# EasyEDA schematic 1-Schematic_EMWAVER_V2_433_RAINSUN.json
TITLE: Sheet_1; REV: 1.0; Date: 2022-12-25; Sheet: 1/1; Drawn By: maarnotto; Company: Your Company
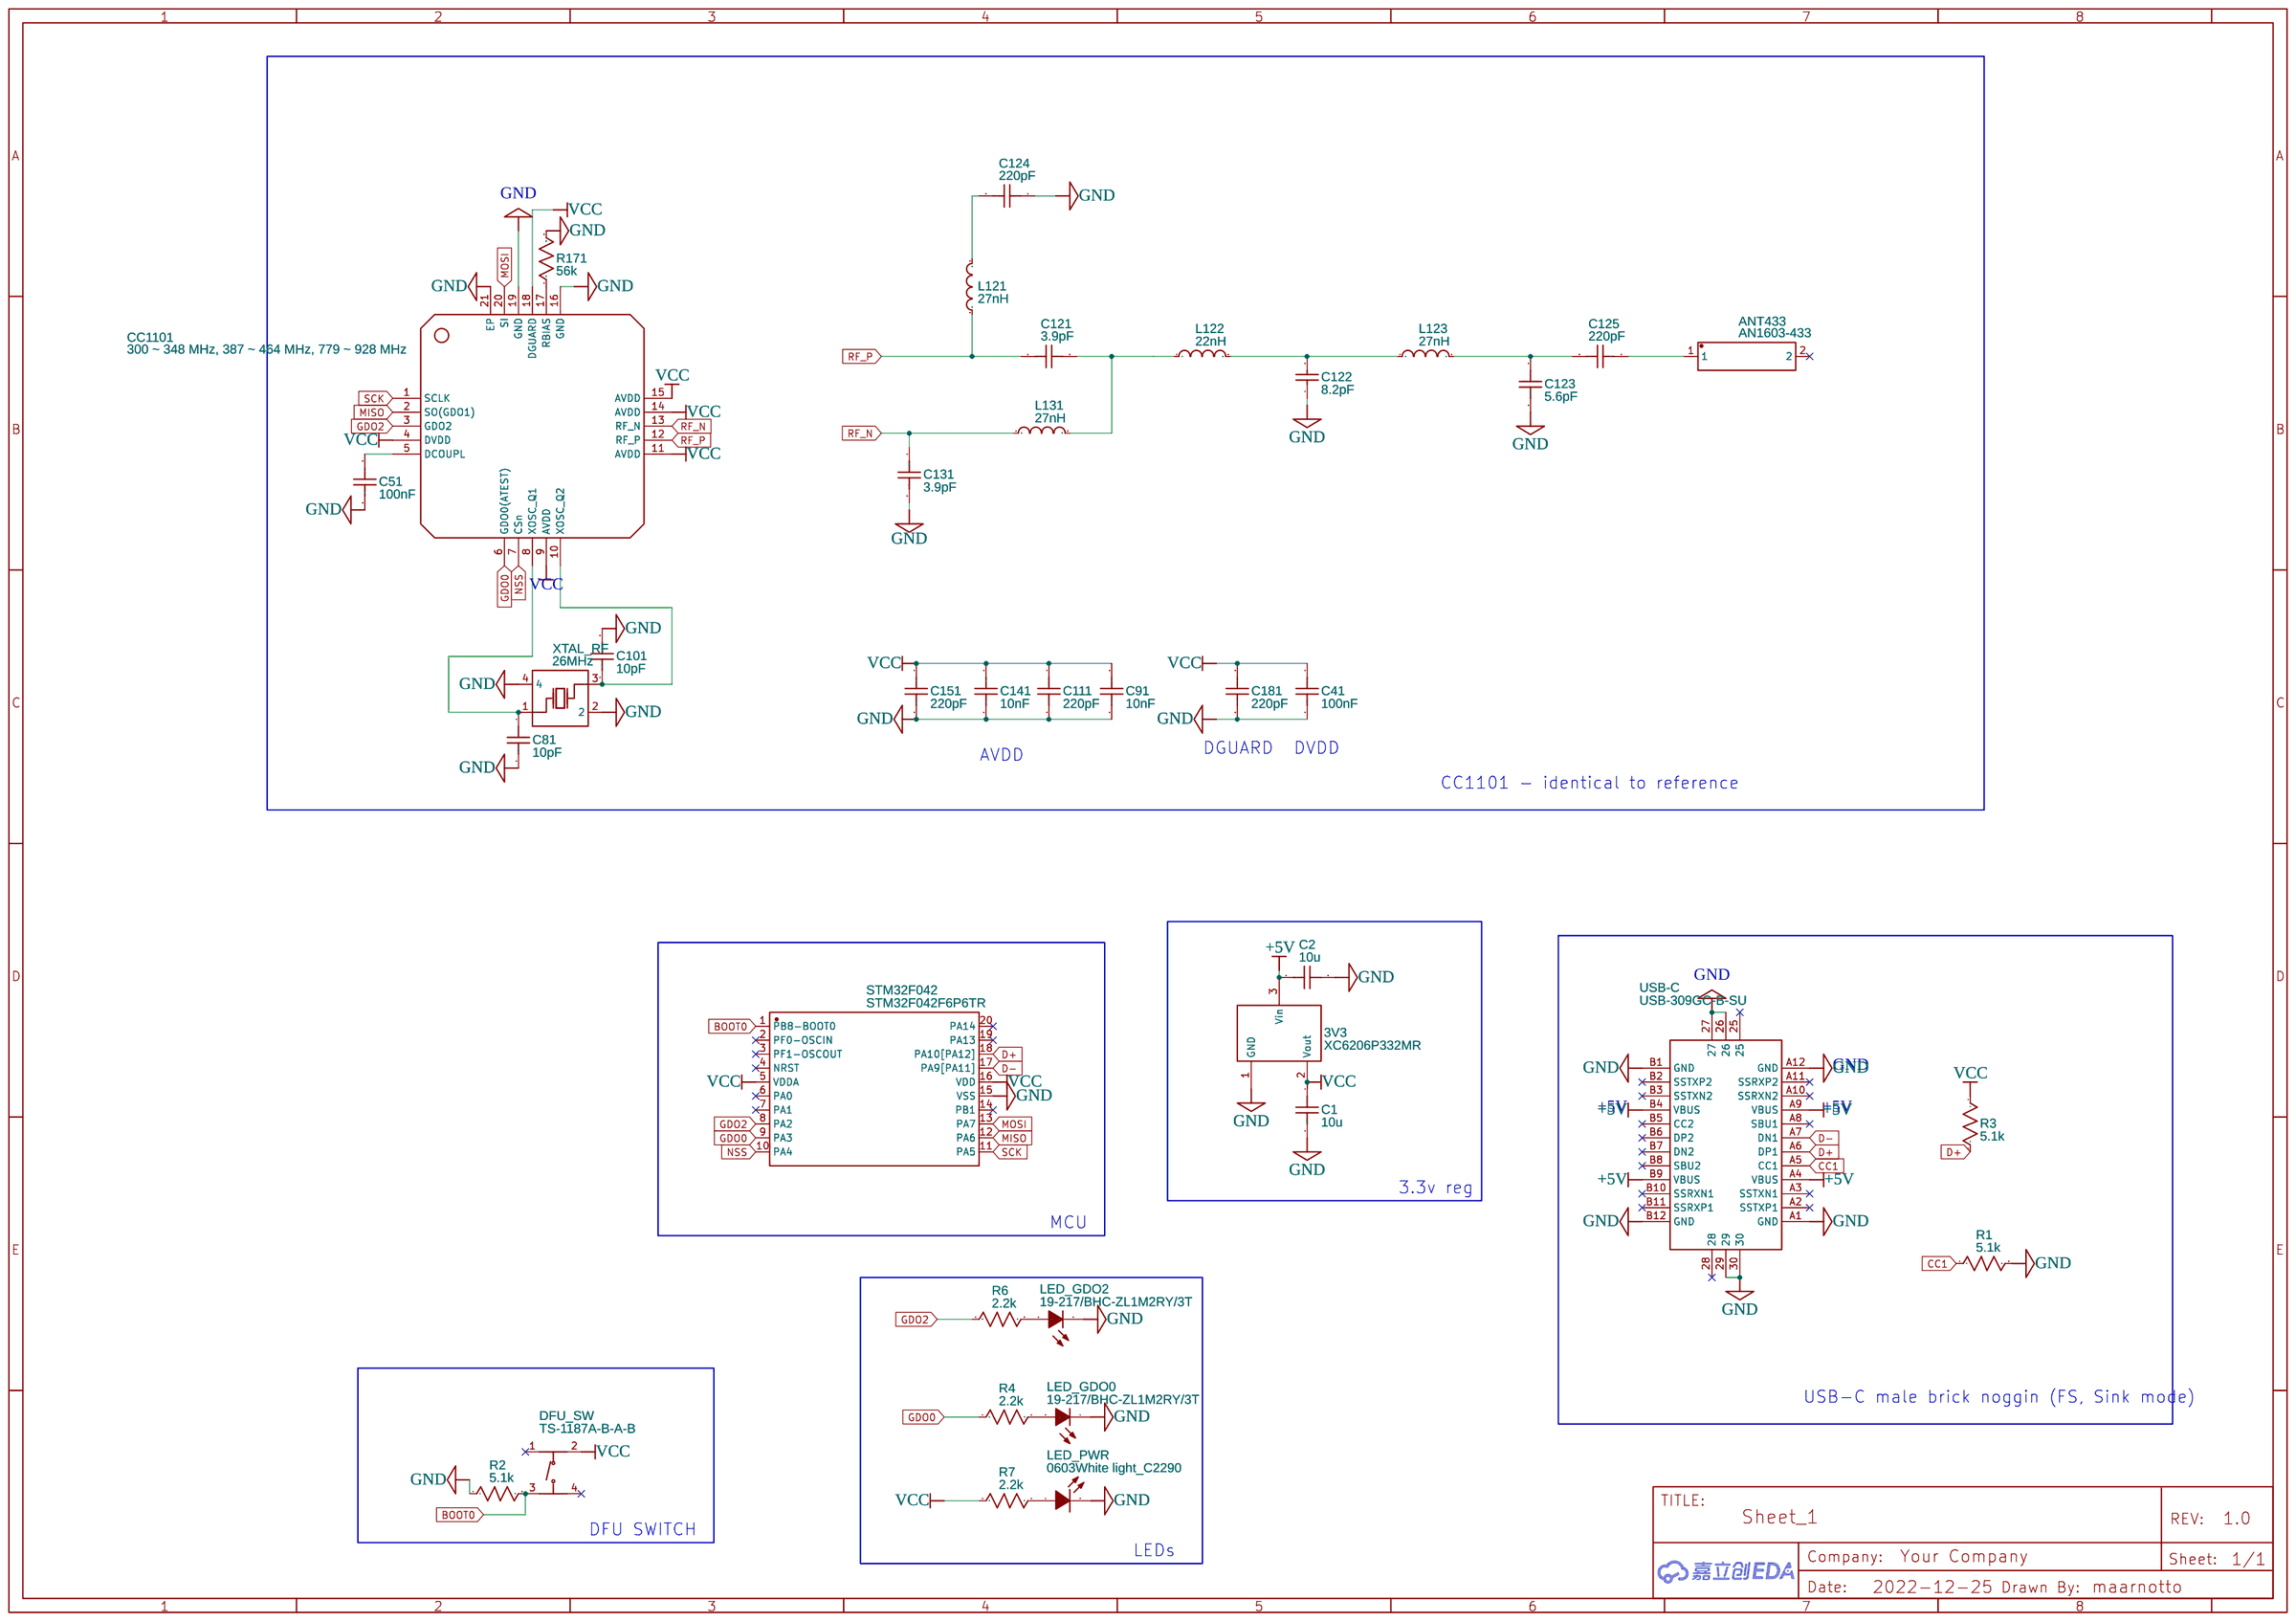
[diagram p0: schematic sheet]

## Parts
3V3  XC6206P332MR  [SOT-23-3_L2.9-W1.6-P1.90-LS2.8-BR]
ANT433  AN1603-433  [ANT-SMD_L16.0-W3.1]
C1  10u  [C0603]
C2  10u  [C0603]
C41  100nF  [C0402]
C51  100nF  [C0402]
C81  10pF  [C0402]
C91  10nF  [C0402]
C101  10pF  [C0402]
C111  220pF  [C0402]
C121  3.9pF  [C0402]
C122  8.2pF  [C0402]
C123  5.6pF  [C0402]
C124  220pF  [C0402]
C125  220pF  [C0402]
C131  3.9pF  [C0402]
C141  10nF  [C0402]
C151  220pF  [C0402]
C181  220pF  [C0402]
CC1101  300 ~ 348 MHz, 387 ~ 464 MHz, 779 ~ 928 MHz  [QFN-20_L4.0-W4.0-P0.5-TL-EP]
DFU_SW  TS-1187A-B-A-B  [SW-SMD_4P-L5.1-W5.1-P3.70-LS6.5-TL-2]
L121  27nH  [L0402]
L122  22nH  [L0402]
L123  27nH  [L0402]
L131  27nH  [L0402]
LED_GDO0  19-217/BHC-ZL1M2RY/3T  [LED0603-RD]
LED_GDO2  19-217/BHC-ZL1M2RY/3T  [LED0603-RD]
LED_PWR  0603White light_C2290  [LED0603-R-RD_WHITE]
R1  5.1k  [R0603]
R2  5.1k  [R0603]
R3  5.1k  [R0603]
R4  2.2k  [R0603]
R6  2.2k  [R0603]
R7  2.2k  [R0603]
R171  56k  [R0402]
STM32F042  STM32F042F6P6TR  [TSSOP-20_L6.5-W4.4-P0.65-LS6.4-BL]
USB-C  USB-309GC-B-SU  [USB-C-SMD_USB-309GC-B-SU]
XTAL_RF  26MHz  [CRYSTAL-SMD_4P-L3.2-W2.5-BL]

## Library data of the parts
3V3 = XC6206P332MR: Supplier: LCSC; Manufacturer: TOREX(特瑞仕); Supplier Part: C5446; JLCPCB Part Class: Basic Part
ANT433 = AN1603-433: Supplier: LCSC; Supplier Part: C122806; Manufacturer: rainsun(霖昱微); Contributor: LCSC; JLCPCB Part Class: Extended Part
C1 C2 = C_0603_US: Contributor: LCEDA_Lib
C41 C51 C81 C91 C101 C111 C121 C123-C125 C131 C141 C151 C181 = C_0402_US: Contributor: LCEDA_Lib
C122 = 0402CG8R2C500NT: Supplier: LCSC; Manufacturer: FH(风华); Supplier Part: C1579; JLCPCB Part Class: Extended Part
CC1101 = CC1101RGPR: Supplier: LCSC; Manufacturer: TI(德州仪器); Supplier Part: C29953; JLCPCB Part Class: Extended Part
DFU_SW = TS-1187A-B-A-B: Supplier: LCSC; Supplier Part: C318884; Manufacturer: XKB Connectivity(中国星坤); Contributor: LCSC; JLCPCB Part Class: Basic Part
L121-L123 L131 = L0402_US: Supplier Part: C14033; Contributor: LCEDA_Lib
LED_GDO0 LED_GDO2 = 19-217/BHC-ZL1M2RY/3T: Supplier: LCSC; Manufacturer: EVERLIGHT(亿光); Supplier Part: C72041; JLCPCB Part Class: Basic Part
LED_PWR = 0603White light_C2290: Supplier: LCSC; Manufacturer: null; Manufacturer Part: KT-0603白灯; Supplier Part: C2290; JLCPCB Part Class: Basic Part
R1-R4 R6 R7 = R_0603_US: Contributor: LCEDA_Lib
R171 = R_0402_US: Contributor: LCEDA_Lib
STM32F042 = STM32F042F6P6TR: Supplier: LCSC; Supplier Part: C2969989; Manufacturer: ST(意法半导体); link: https://atta.szlcsc.com/upload/public/pdf/source/20180326/C88048_75CEBEF3F549B3F081FE2DB403271B9C.pdf; Contributor: lcsc; JLCPCB Part Class: Extended Part
USB-C = USB-309GC-B-SU: Contributor: LCSC; Supplier: LCSC; Supplier Part: C309336; Manufacturer: HOOYA; JLCPCB Part Class: Extended Part
XTAL_RF = 3S26000333: Supplier: LCSC; Supplier Part: C431163; Manufacturer: YL(惠伦晶体); Contributor: LCSC; JLCPCB Part Class: Extended Part

## Nets
+5V: 3V3.3(Vin) C2.2 USB-C.A4(VBUS) USB-C.A9(VBUS) USB-C.B4(VBUS) USB-C.B9(VBUS)
GND: 3V3.1(GND) C1.2 C2.1 C41.2 C51.2 C81.2 C91.2 C101.2 C111.2 C122.1 C123.2 C124.1 C131.2 C141.2 C151.2 C181.2 CC1101.16(GND) CC1101.19(GND) CC1101.21(EP) LED_GDO0.1(C) LED_GDO2.1(C) LED_PWR.2(K) R1.2 R2.1 R171.2 STM32F042.15(VSS) USB-C.26 USB-C.27 USB-C.29 USB-C.30 USB-C.A1(GND) USB-C.A12(GND) USB-C.B1(GND) USB-C.B12(GND) XTAL_RF.2 XTAL_RF.4
VCC: 3V3.2(Vout) C1.1 C41.1 C91.1 C111.1 C141.1 C151.1 C181.1 CC1101.4(DVDD) CC1101.9(AVDD) CC1101.11(AVDD) CC1101.14(AVDD) CC1101.15(AVDD) CC1101.18(DGUARD) DFU_SW.2(B) R3.1 R7.1 STM32F042.5(VDDA) STM32F042.16(VDD)
BOOT0: DFU_SW.3(C) R2.2 STM32F042.1(PB8-BOOT0)
CC1: R1.1 USB-C.A5(CC1)
D+: R3.2 STM32F042.18(PA10[PA12]) USB-C.A6(DP1)
D-: STM32F042.17(PA9[PA11]) USB-C.A7(DN1)
GDO0: CC1101.6(GDO0(ATEST)) R4.1 STM32F042.9(PA3)
GDO2: CC1101.3(GDO2) R6.1 STM32F042.8(PA2)
MISO: CC1101.2(SO(GDO1)) STM32F042.12(PA6)
MOSI: CC1101.20(SI) STM32F042.13(PA7)
NSS: CC1101.7(CSn) STM32F042.10(PA4)
RF_N: C131.1 CC1101.13(RF_N) L131.1
RF_P: C121.2 CC1101.12(RF_P) L121.1
SCK: CC1101.1(SCLK) STM32F042.11(PA5)
Net-(ANT433-1): ANT433.1 C125.1
Net-(C51-1): C51.1 CC1101.5(DCOUPL)
Net-(C81-1): C81.1 CC1101.8(XOSC_Q1) XTAL_RF.1(OSC1)
Net-(C101-1): C101.1 CC1101.10(XOSC_Q2) XTAL_RF.3(OSC2)
Net-(C121-1): C121.1 L122.1 L131.2
Net-(C122-2): C122.2 L122.2 L123.1
Net-(C123-1): C123.1 C125.2 L123.2
Net-(C124-2): C124.2 L121.2
Net-(CC1101-17): CC1101.17(RBIAS) R171.1
Net-(LED_GDO0-2): LED_GDO0.2(A) R4.2
Net-(LED_GDO2-2): LED_GDO2.2(A) R6.2
Net-(LED_PWR-1): LED_PWR.1(A) R7.2

Not connected (* = marked no-connect by the designer): ANT433 2*; DFU_SW 1(A)* 4(D)*; STM32F042 2(PF0-OSCIN)* 3(PF1-OSCOUT)* 4(NRST)* 6(PA0)* 7(PA1)* 14(PB1)* 19(PA13)* 20(PA14)*; USB-C 25* 28* A2(SSTXP1)* A3(SSTXN1)* A8(SBU1)* A10(SSRXN2)* A11(SSRXP2)* B2(SSTXP2)* B3(SSTXN2)* B5(CC2)* B6(DP2)* B7(DN2)* B8(SBU2)* B10(SSRXN1)* B11(SSRXP1)*

## Notes on the sheet
- AVDD
- DGUARD
- DVDD
- CC1101 - identical to reference
- GND
- +5V
- +5V
- 3.3v reg
- MCU
- USB-C male brick noggin (FS, Sink mode)
- DFU SWITCH
- LEDs
